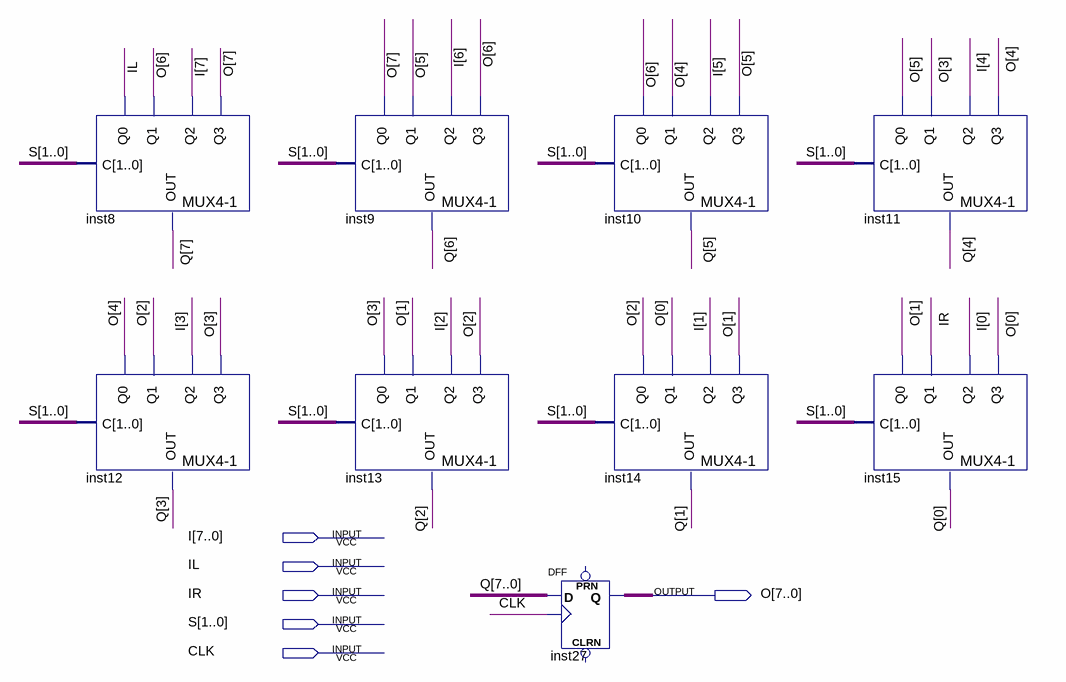
[diagram p0: schematic sheet]
// Quartus schematic Shiftleff.bdf as structural Verilog: 9 symbols, 6 pins
module Shiftleff (
  input  [7:0] I,
  input  IL,
  input  IR,
  input  [1:0] S,
  input  CLK,
  output [7:0] O
);

  wire [7:0] Q;

  \MUX4-1  inst8 (.Q3(O[7]), .Q2(I[7]), .Q1(O[6]), .Q0(IL), .C(S), .OUT(Q[7]));
  \MUX4-1  inst12 (.Q3(O[3]), .Q2(I[3]), .Q1(O[2]), .Q0(O[4]), .C(S), .OUT(Q[3]));
  \MUX4-1  inst9 (.Q3(O[6]), .Q2(I[6]), .Q1(O[5]), .Q0(O[7]), .C(S), .OUT(Q[6]));
  \MUX4-1  inst13 (.Q3(O[2]), .Q2(I[2]), .Q1(O[1]), .Q0(O[3]), .C(S), .OUT(Q[2]));
  DFF inst27[7:0] (.CLK(CLK), .D(Q), .Q(O));  // open: CLRN, PRN
  \MUX4-1  inst10 (.Q3(O[5]), .Q2(I[5]), .Q1(O[4]), .Q0(O[6]), .C(S), .OUT(Q[5]));
  \MUX4-1  inst14 (.Q3(O[1]), .Q2(I[1]), .Q1(O[0]), .Q0(O[2]), .C(S), .OUT(Q[1]));
  \MUX4-1  inst11 (.Q3(O[4]), .Q2(I[4]), .Q1(O[3]), .Q0(O[5]), .C(S), .OUT(Q[4]));
  \MUX4-1  inst15 (.Q3(O[0]), .Q2(I[0]), .Q1(IR), .Q0(O[1]), .C(S), .OUT(Q[0]));
endmodule
